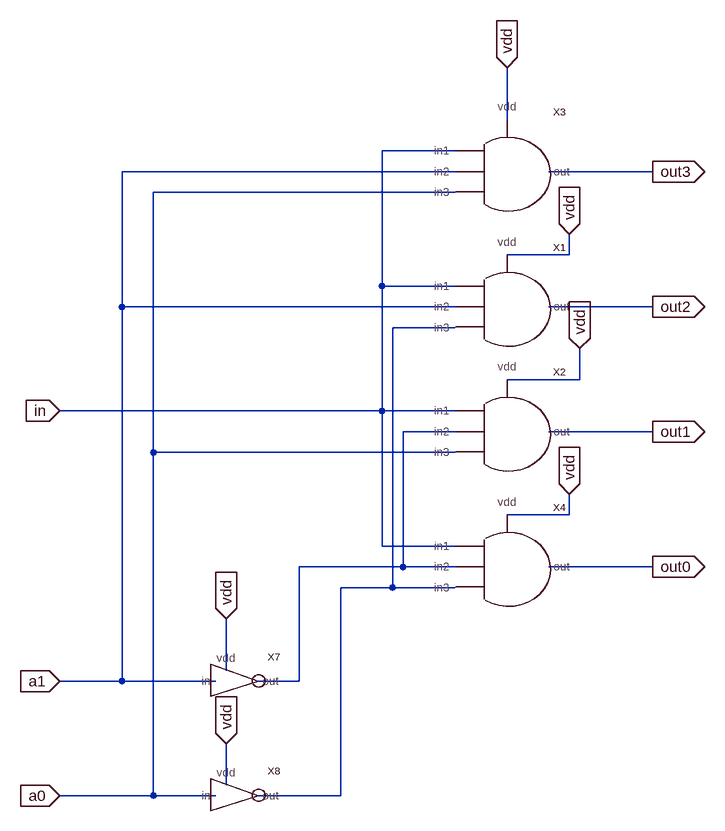
[diagram p0: schematic demux4.asc]
demux4.asc, the LTspice schematic file:
Version 4
SHEET 1 1572 916
WIRE -192 -608 -192 -688
WIRE -272 -560 -384 -560
WIRE -272 -528 -784 -528
WIRE 32 -528 -128 -528
WIRE -272 -496 -736 -496
WIRE -96 -400 -96 -432
WIRE -96 -400 -192 -400
WIRE -384 -352 -384 -560
WIRE -272 -352 -384 -352
WIRE -784 -320 -784 -528
WIRE -272 -320 -784 -320
WIRE 32 -320 -128 -320
WIRE -272 -288 -368 -288
WIRE -80 -208 -80 -256
WIRE -80 -208 -192 -208
WIRE -384 -160 -384 -352
WIRE -384 -160 -880 -160
WIRE -272 -160 -384 -160
WIRE -272 -128 -352 -128
WIRE 32 -128 -128 -128
WIRE -736 -96 -736 -496
WIRE -272 -96 -736 -96
WIRE -96 0 -96 -32
WIRE -96 0 -192 0
WIRE -384 48 -384 -160
WIRE -272 48 -384 48
WIRE -352 80 -352 -128
WIRE -352 80 -512 80
WIRE -272 80 -352 80
WIRE 32 80 -128 80
WIRE -368 112 -368 -288
WIRE -368 112 -448 112
WIRE -272 112 -368 112
WIRE -624 240 -624 160
WIRE -784 256 -784 -320
WIRE -784 256 -880 256
WIRE -640 256 -784 256
WIRE -512 256 -512 80
WIRE -512 256 -576 256
WIRE -624 416 -624 352
WIRE -736 432 -736 -96
WIRE -736 432 -880 432
WIRE -640 432 -736 432
WIRE -448 432 -448 112
WIRE -448 432 -576 432
FLAG -880 -160 in
IOPIN -880 -160 In
FLAG 32 -528 out3
IOPIN 32 -528 Out
FLAG 32 -320 out2
IOPIN 32 -320 Out
FLAG 32 -128 out1
IOPIN 32 -128 Out
FLAG 32 80 out0
IOPIN 32 80 Out
FLAG -880 256 a1
IOPIN -880 256 In
FLAG -880 432 a0
IOPIN -880 432 In
FLAG -192 -688 vdd
IOPIN -192 -688 In
FLAG -96 -432 vdd
IOPIN -96 -432 In
FLAG -80 -256 vdd
IOPIN -80 -256 In
FLAG -96 -32 vdd
IOPIN -96 -32 In
FLAG -624 160 vdd
IOPIN -624 160 In
FLAG -624 352 vdd
IOPIN -624 352 In
SYMBOL and3 -192 -320 R0
SYMATTR InstName X1
SYMBOL and3 -192 -128 R0
SYMATTR InstName X2
SYMBOL and3 -192 -528 R0
SYMATTR InstName X3
SYMBOL and3 -192 80 R0
SYMATTR InstName X4
SYMBOL inverter -624 256 R0
SYMATTR InstName X7
SYMBOL inverter -624 432 R0
SYMATTR InstName X8

The netlist it stands for:
* demux4.asc
XX1 in a1 N001 out2 vdd and3  ; pins in1 in2 in3 out vdd
XX2 in N002 a0 out1 vdd and3  ; pins in1 in2 in3 out vdd
XX3 in a1 a0 out3 vdd and3  ; pins in1 in2 in3 out vdd
XX4 in N002 N001 out0 vdd and3  ; pins in1 in2 in3 out vdd
XX7 vdd N002 a1 inverter  ; pins vdd out in
XX8 vdd N001 a0 inverter  ; pins vdd out in
.backanno
.end